# Altium project IMU_sensor.PrjPcb
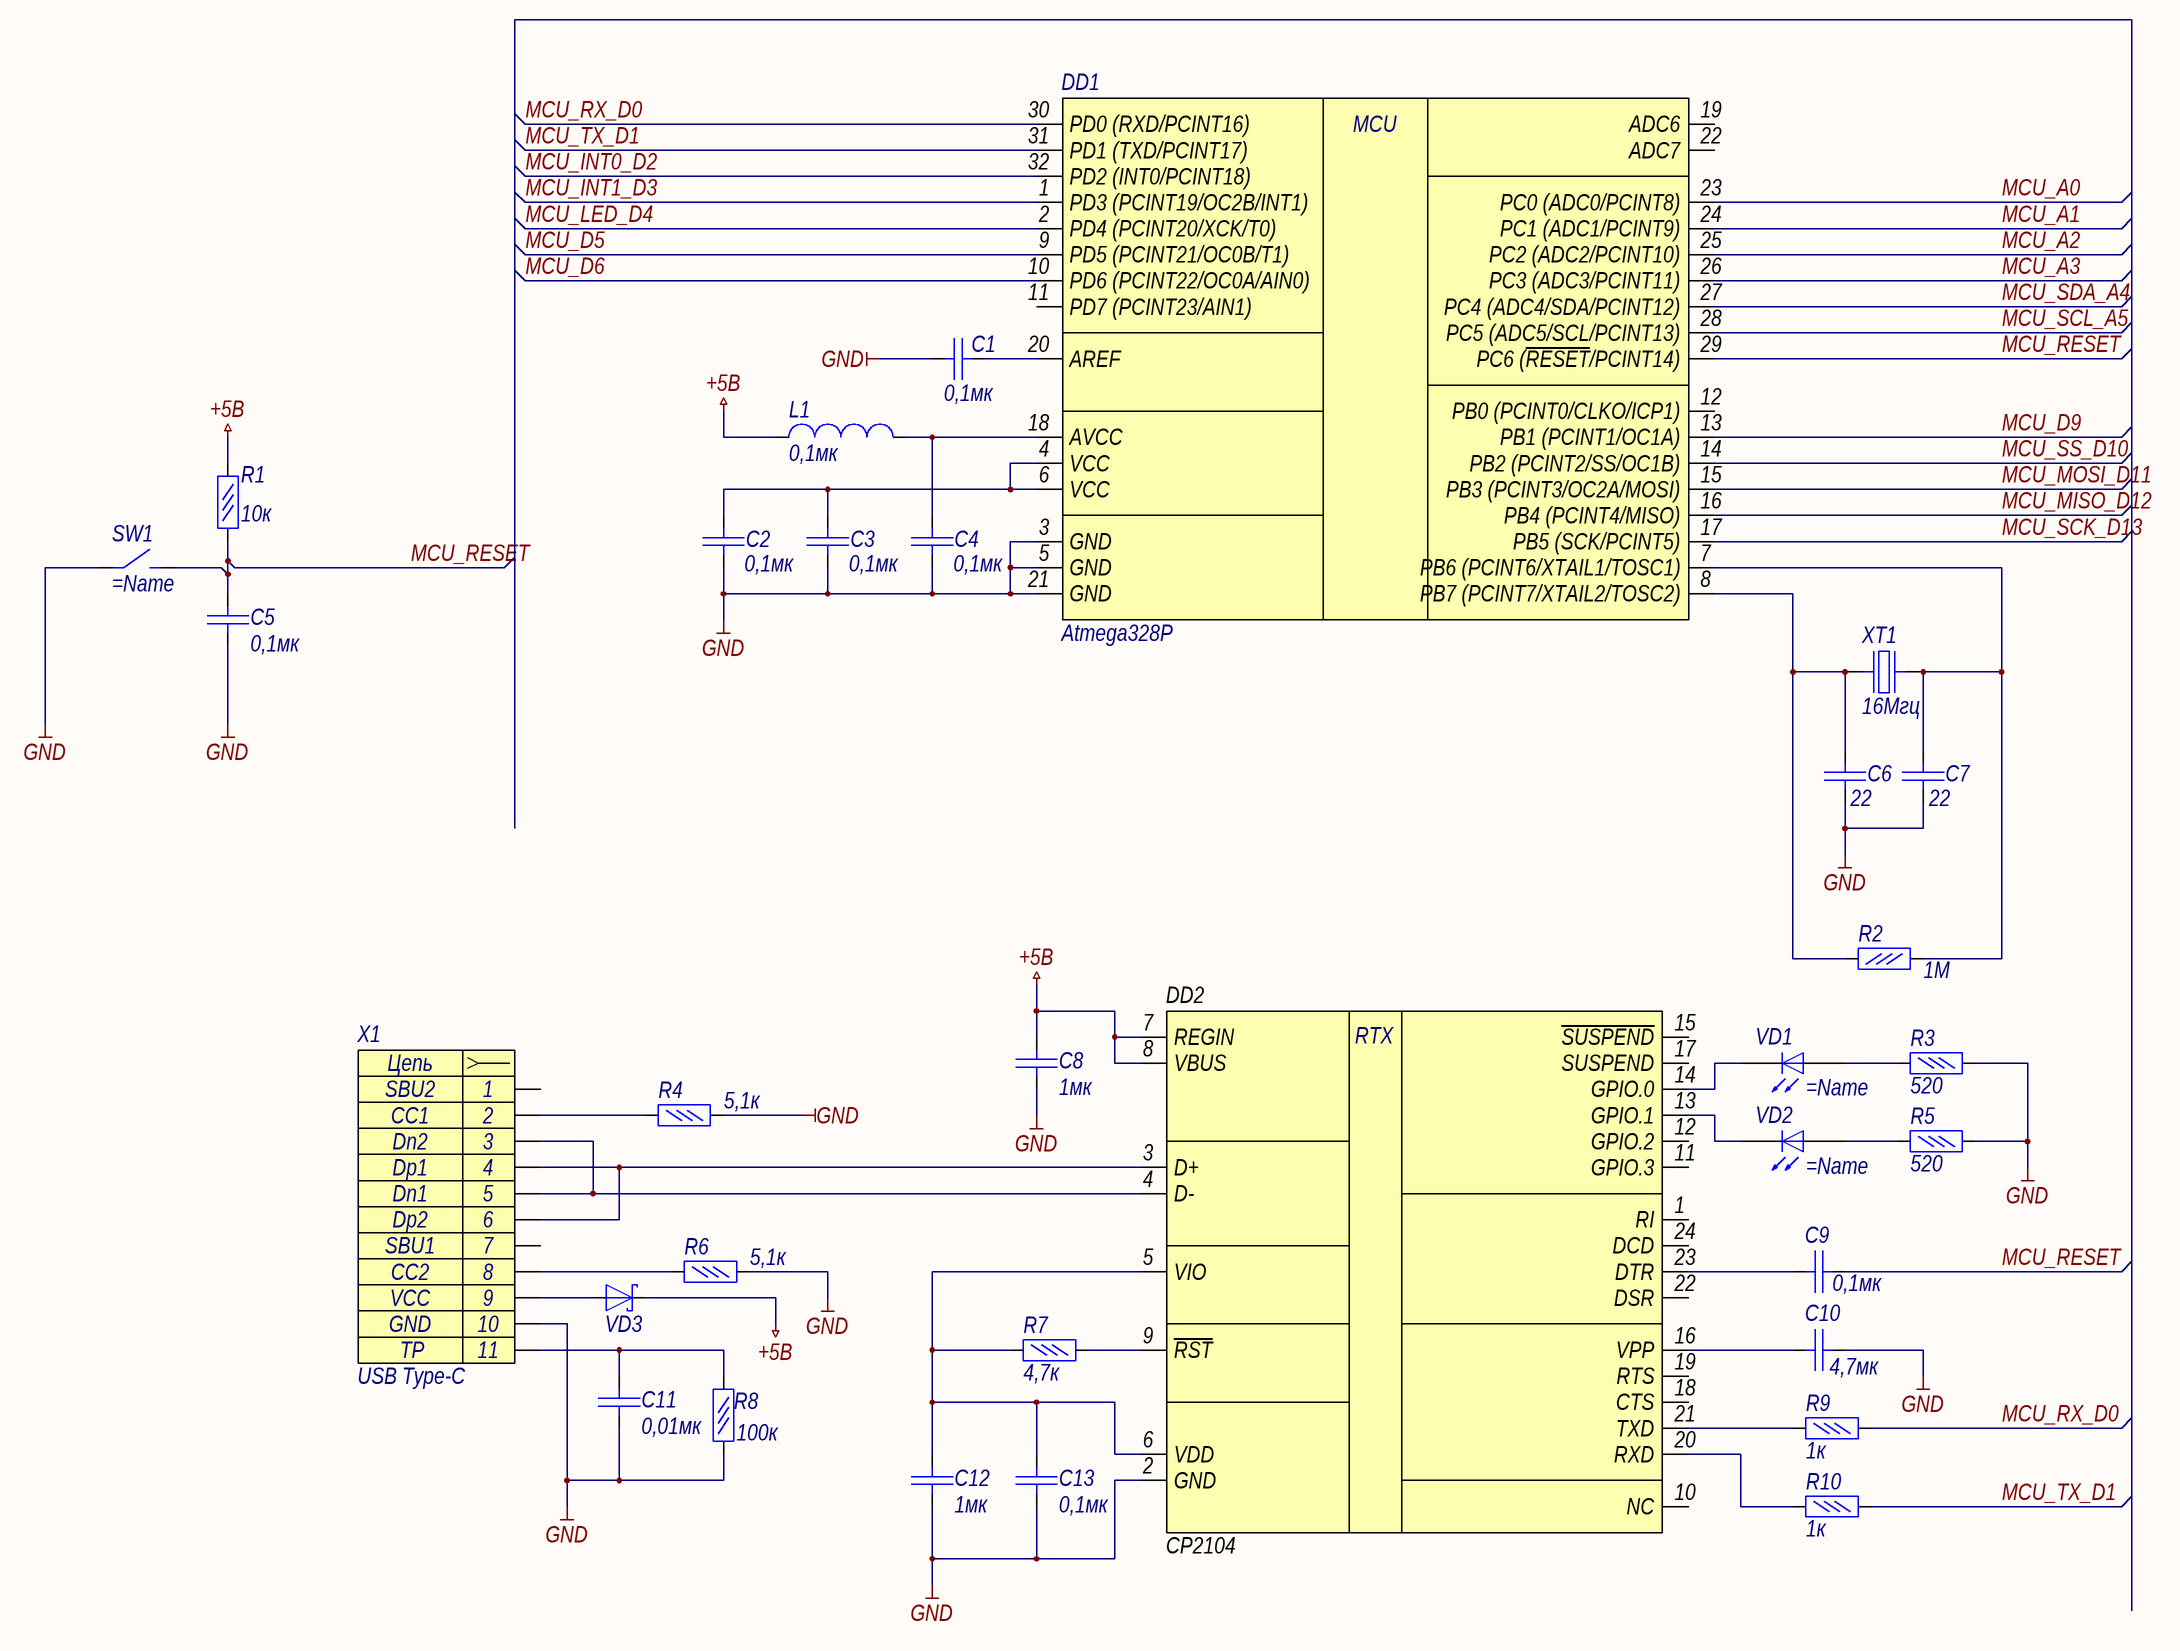
[diagram p0: IMU_sensor_mcu.SchDoc]
4 sheets, 81 parts. Net scope: global (net labels, ports and power ports of the same name join across sheets).
Board file: IMU_sensor.PcbDoc
Sheets:
  IMU_sensor_mcu.SchDoc
  IMU_sensor_gyro.SchDoc
  IMU_sensor_pwr.SchDoc
  MCU_sensor_peripherial.SchDoc

## Sheet IMU_sensor_mcu.SchDoc
size 594 x 420 mm; SheetNumber: 1; SheetTotal: 4

### Parts
DD1  Atmega328P  [VQFN32]
DD2  CP2104  [QFN24-PAD]
L1  0,1мк  [L0603]
R1  10к  [R0402]
R2  1М  [R0402]
R3  520  [R0402]
R4  5,1к  [R0402]
R5  520  [R0402]
R6  5,1к  [R0402]
R7  4,7к  [R0402]
R8  100к  [R0402]
R9  1к  [R0402]
R10  1к  [R0402]
SW1  (no value)  [it-1187]
VD1  (no value)  [0603 - led]
VD2  (no value)  [0603 - led]
VD3  (no value)  [SOD323]
X1  USB Type-C  [USB4105-15-A-120]
XT1  16Мгц  [KX-7]
С1  0,1мк  [C0402]
С2  0,1мк  [C0402]
С3  0,1мк  [C0402]
С4  0,1мк  [C0402]
С5  0,1мк  [C0603]
С6  22  [C0402]
С7  22  [C0402]
С8  1мк  [C0402]
С9  0,1мк  [C0402]
С10  4,7мк  [C0603]
С11  0,01мк  [C0402]
С12  1мк  [C0402]
С13  0,1мк  [C0402]

### Nets
+5В: DD2.7(REGIN) DD2.8(VBUS) L1.2 R1.1 VD3.1(K) С8.1
GND: DD1.3(GND) DD1.5(GND) DD1.21(GND) DD2.2(GND) R3.2 R4.2 R5.2 R6.2 R8.1 SW1.1 X1.10(VCC) С1.1 С2.1 С3.1 С4.1 С5.2 С6.1 С7.1 С8.2 С10.1 С11.1 С12.1 С13.1
MCU_A0: DD1.23(PC0_(ADC0/PCINT8))
MCU_A1: DD1.24(PC1_(ADC1/PCINT9))
MCU_A2: DD1.25(PC2_(ADC2/PCINT10))
MCU_A3: DD1.26(PC3_(ADC3/PCINT11))
MCU_D5: DD1.9(PD5_(PCINT21/OC0B/T1))
MCU_D6: DD1.10(PD6_(PCINT22/OC0A/AIN0))
MCU_D9: DD1.13(PB1_(PCINT1/OC1A))
MCU_INT0_D2: DD1.32(PD2_(INT0/PCINT18))
MCU_INT1_D3: DD1.1(PD3_(PCINT19/OC2B/INT1))
MCU_LED_D4: DD1.2(PD4_(PCINT20/XCK/T0))
MCU_MISO_D12: DD1.16(PB4_(PCINT4/MISO))
MCU_MOSI_D11: DD1.15(PB3_(PCINT3/OC2A/MOSI))
MCU_RESET: DD1.29(PC6_(~{RESET}/PCINT14)) R1.2 SW1.2 С5.1 С9.1
MCU_RX_D0: DD1.30(PD0_(RXD/PCINT16)) R9.2
MCU_SCK_D13: DD1.17(PB5_(SCK/PCINT5))
MCU_SCL_A5: DD1.28(PC5_(ADC5/SCL/PCINT13))
MCU_SDA_A4: DD1.27(PC4_(ADC4/SDA/PCINT12))
MCU_SS_D10: DD1.14(PB2_(PCINT2/SS/OC1B))
MCU_TX_D1: DD1.31(PD1_(TXD/PCINT17)) R10.2
NetDD1_4: DD1.4(VCC) DD1.6(VCC) С2.2 С3.2
NetDD1_7: DD1.7(PB6_(PCINT6/XTAIL1/TOSC1)) R2.2 XT1.3 С7.2
NetDD1_8: DD1.8(PB7_(PCINT7/XTAIL2/TOSC2)) R2.1 XT1.1 С6.2
NetDD1_18: DD1.18(AVCC) L1.1 С4.2
NetDD1_20: DD1.20(AREF) С1.2
NetDD2_3: DD2.3(D+) X1.4(A6) X1.6(B6)
NetDD2_4: DD2.4(D-) X1.3(B7) X1.5(A7)
NetDD2_5: DD2.5(VIO) DD2.6(VDD) R7.2 С12.2 С13.2
NetDD2_9: DD2.9(~{RST}) R7.1
NetDD2_13: DD2.13(GPIO.1) VD2.2(K)
NetDD2_14: DD2.14(GPIO.0) VD1.2(K)
NetDD2_16: DD2.16(VPP) С10.2
NetDD2_20: DD2.20(RXD) R10.1
NetDD2_21: DD2.21(TXD) R9.1
NetDD2_23: DD2.23(DTR) С9.2
NetR3_1: R3.1 VD1.1(A)
NetR4_1: R4.1 X1.2(A5)
NetR5_1: R5.1 VD2.1(A)
NetR6_1: R6.1 X1.8(B5)
NetR8_2: R8.2 X1.TP С11.2
NetVD3_2: VD3.2(A) X1.9(GND)

Not connected (* = marked no-connect by the designer): DD1 11(PD7_(PCINT23/AIN1)) 12(PB0_(PCINT0/CLKO/ICP1)) 19(ADC6) 22(ADC7); DD2 1(RI) 10(NC) 11(GPIO.3) 12(GPIO.2) 15(~{SUSPEND}) 17(SUSPEND) 18(CTS) 19(RTS) 22(DSR) 24(DCD); X1 1(B8) 7(A8)

### Notes on the sheet
- Перв. примен.
- Справ. №
- Подп. и дата
- Инв. № дубл.
- Нормоконтроль:
- Взам. инв. №
- Изм.
- Лист
- № докум.
- Подп.
- Дата
- Лит.
- Масса
- Масштаб
- Т.контр.
- Пров.
- Разраб.
- Листов
- Разработал:
- Инв. № подл.
- Н.контр.
- Утв.
- Копировал
- Формат
- А2
- (in symbol Atmega328P) MCU
- (in symbol CP2104) RTX
- (in symbol USB4105) Цепь; 11

### Library data of the parts
DD1 = Atmega328P: Atmega328P-MU; Name: Atmega328P
L1 = индуктивность: Value: 0,1мк
R1-R10 = Резистор 0.05Вт: Резистор 0,05Вт
  R1: Value: 10к
  R2: Value: 1М
  R3 R5: Value: 520
  R4 R6: Value: 5,1к
  R7: Value: 4,7к
  R8: Value: 100к
  R9 R10: Value: 1к
SW1 = button
VD1 VD2 = smd_led: smd led
VD3 = DiodeSchottky: Диод Шоттки
X1 = USB4105: USB Type-C USB4105-GF-A / GCT; Contact_1: SBU2; Contact_2: CC1; Contact_3: Dn2; Contact_4: Dp1; Contact_5: Dn1; Contact_6: Dp2; Contact_7: SBU1; Contact_8: CC2; Contact_9: VCC; Contact_10: GND; Name: USB Type-C
XT1 = Резонатор: 12.88605 / Geyer; Name: 12.88605; Value: 16Мгц
С1-С13 = Кер. конденсатор
  С1-С5 С9 С13: Value: 0,1мк
  С6 С7: Value: 22
  С8 С12: Value: 1мк
  С10: Value: 4,7мк
  С11: Value: 0,01мк
DD2 = CP2104: Наименование: CP2104

## Sheet IMU_sensor_gyro.SchDoc
size 420 x 297 mm; SheetNumber: 2; SheetTotal: 4
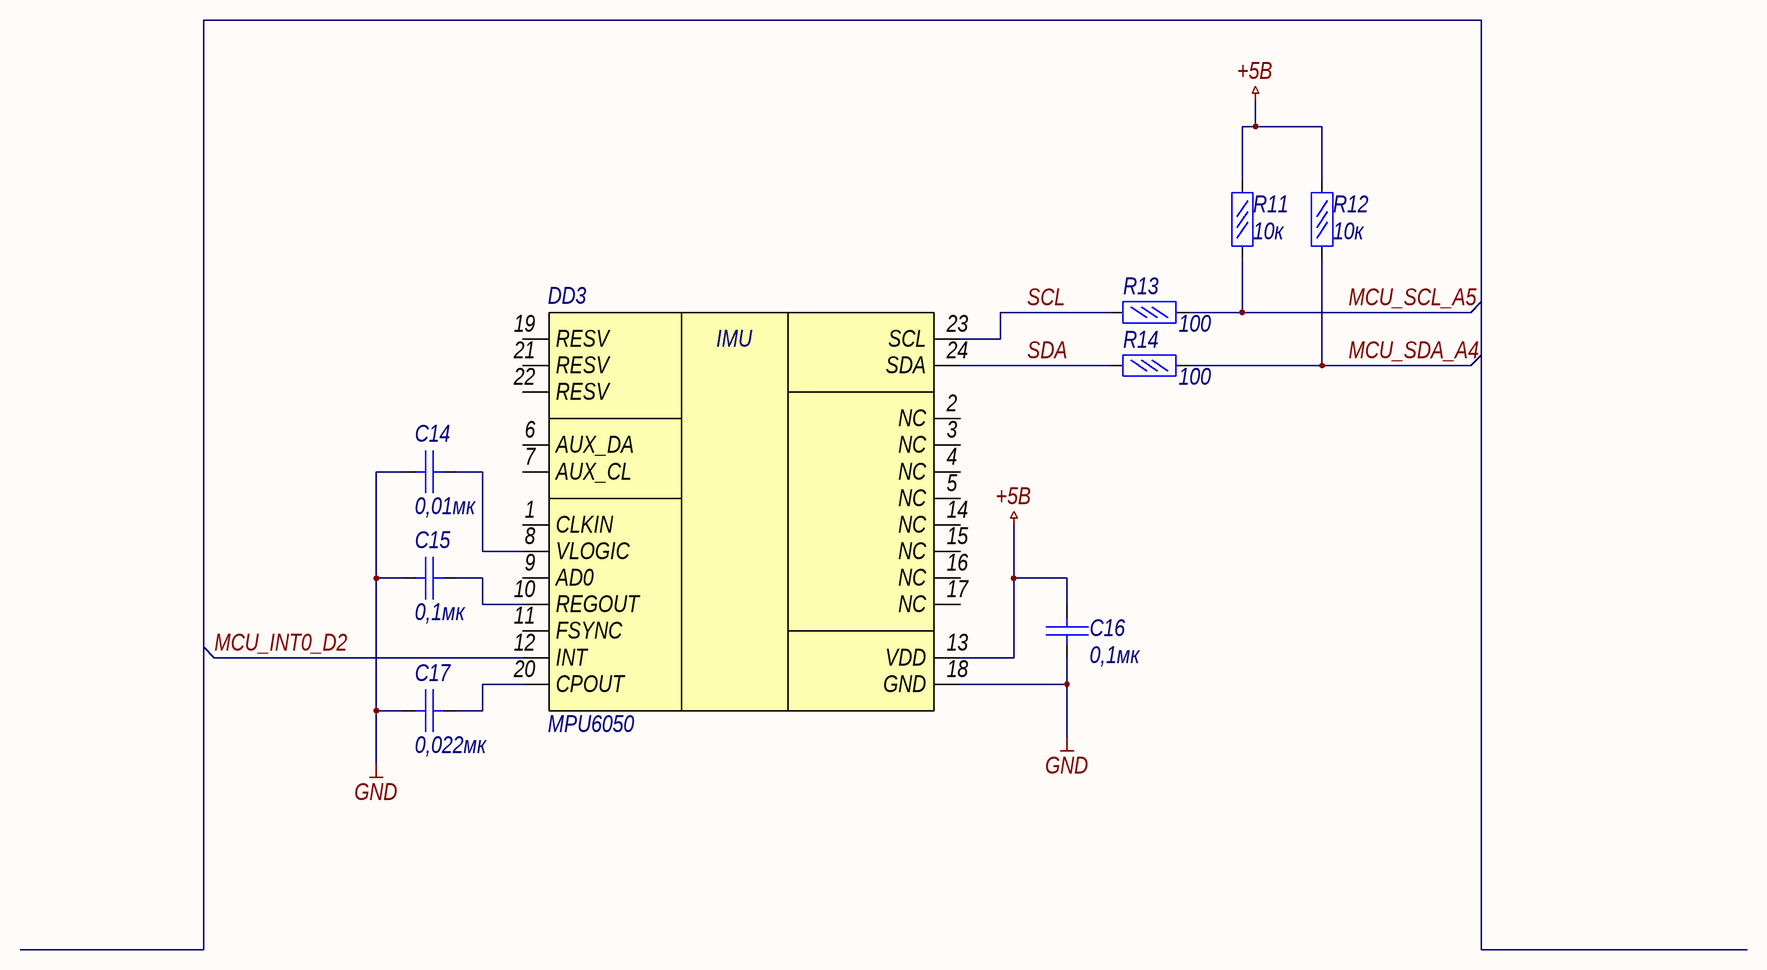
[diagram p1: IMU_sensor_gyro.SchDoc]

### Parts
DD3  MPU6050  [QFN24-PAD]
R11  10к  [R0402]
R12  10к  [R0402]
R13  100  [R0402]
R14  100  [R0402]
С14  0,01мк  [C0402]
С15  0,1мк  [C0402]
С16  0,1мк  [C0402]
С17  0,022мк  [C0402]

### Nets
+5В: DD3.13(VDD) R11.2 R12.2 С16.2
GND: DD3.18(GND) С14.1 С15.1 С16.1 С17.1
MCU_INT0_D2: DD3.12(INT)
MCU_SCL_A5: R11.1 R13.1
MCU_SDA_A4: R12.1 R14.1
SCL: DD3.23(SCL) R13.2
SDA: DD3.24(SDA) R14.2
NetDD3_8: DD3.8(VLOGIC) С14.2
NetDD3_10: DD3.10(REGOUT) С15.2
NetDD3_20: DD3.20(CPOUT) С17.2

Not connected (* = marked no-connect by the designer): DD3 1(CLKIN) 2(NC) 3(NC) 4(NC) 5(NC) 6(AUX_DA) 7(AUX_CL) 9(AD0) 11(FSYNC) 14(NC) 15(NC) 16(NC) 17(NC) 19(RESV) 21(RESV) 22(RESV)

### Notes on the sheet
- Подп. и дата
- Инв. № дубл.
- Взам. инв. №
- Инв. № подл.
- Лист
- Изм.
- № докум.
- Подп.
- Дата
- Копировал
- Формат
- А3
- (in symbol MPU6050) IMU

### Library data of the parts
R11-R14 = Резистор 0.05Вт: Резистор 0,05Вт
  R11 R12: Value: 10к
  R13 R14: Value: 100
С14-С17 = Кер. конденсатор
  С14: Value: 0,01мк
  С15 С16: Value: 0,1мк
  С17: Value: 0,022мк
DD3 = MPU6050: Name: MPU6050

## Sheet IMU_sensor_pwr.SchDoc
size 420 x 297 mm; SheetNumber: 3; SheetTotal: 4
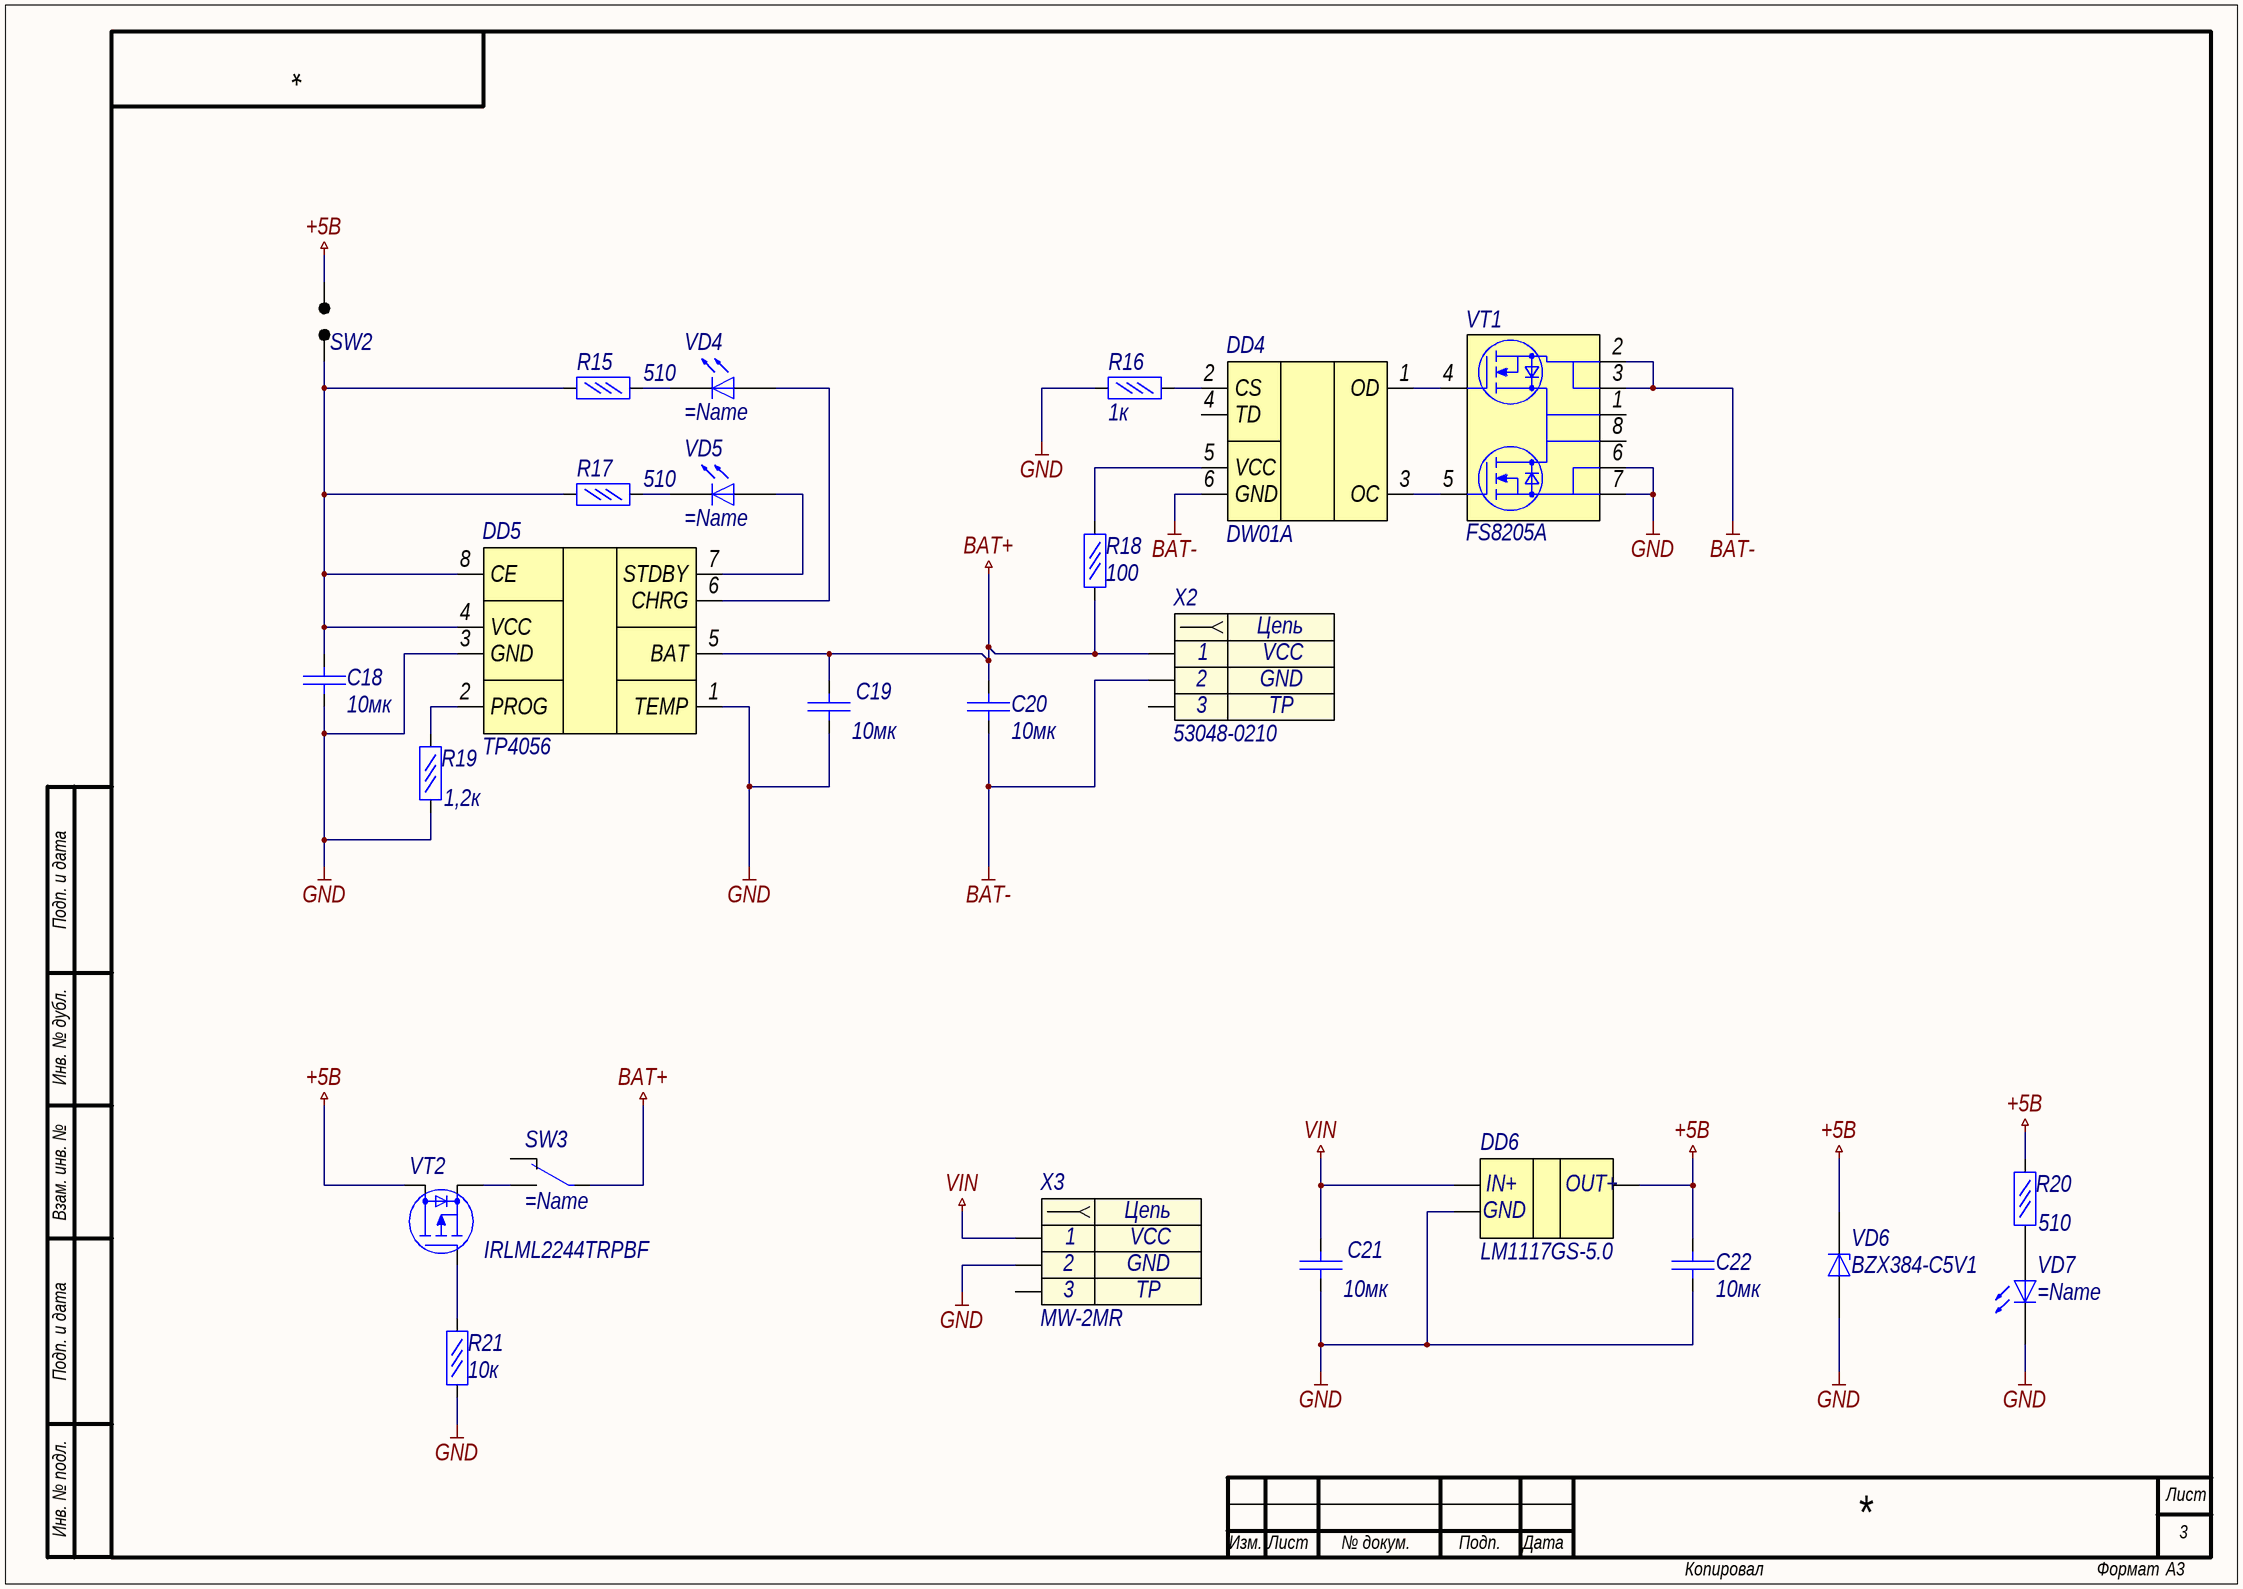
[diagram p2: IMU_sensor_pwr.SchDoc]

### Parts
DD4  DW01A  [SOT23-6]
DD5  TP4056  [SOP-8]
DD6  LM1117GS-5.0  [SOT-223]
R15  510  [R0402]
R16  1к  [R0402]
R17  510  [R0402]
R18  100  [R0402]
R19  1,2к  [R0402]
R20  510  [R0402]
R21  10к  [R0402]
SW2  (no value)  [Jumper_0.5x1]
SW3  (no value)  [MK12C02]
VD4  (no value)  [0603 - led]
VD5  (no value)  [0603 - led]
VD6  BZX384-C5V1  [SOD323]
VD7  (no value)  [0603 - led]
VT1  FS8205A  [TSSOP-8]
VT2  IRLML2244TRPBF  [SOT23]
X2  53048-0210  [53048-0210]
X3  MW-2MR  [MW-2MR]
С18  10мк  [C0603]
С19  10мк  [C0603]
С20  10мк  [C0603]
С21  10мк  [C0603]
С22  10мк  [C0603]

### Nets
+5В: DD6.2 R20.2 SW2.2 VD6.2(K) VT2.3(D) С22.2
BAT+: DD5.5(BAT) R18.2 SW3.1 X2.1 С19.2 С20.1
BAT-: DD4.6(GND) VT1.2(S1) VT1.3(S1) X2.2 С20.2
GND: DD5.1(TEMP) DD5.3(GND) DD6.1 R16.2 R19.1 R21.2 VD6.1(A) VD7.2(K) VT1.6(S2) VT1.7(S2) X3.2 С18.2 С19.1 С21.1 С22.1
VIN: DD6.3 X3.1 С21.2
NetDD4_1: DD4.1(OD) VT1.4(G1)
NetDD4_2: DD4.2(CS) R16.1
NetDD4_3: DD4.3(OC) VT1.5(G2)
NetDD4_5: DD4.5(VCC) R18.1
NetDD5_2: DD5.2(PROG) R19.2
NetDD5_4: DD5.4(VCC) DD5.8(CE) R15.2 R17.2 SW2.1 С18.1
NetDD5_6: DD5.6(CHRG) VD4.1(A)
NetDD5_7: DD5.7(STDBY) VD5.1(A)
NetR15_1: R15.1 VD4.2(K)
NetR17_1: R17.1 VD5.2(K)
NetR20_1: R20.1 VD7.1(A)
NetR21_1: R21.1 VT2.1(G)
NetSW3_3: SW3.3 VT2.2(S)

Not connected (* = marked no-connect by the designer): DD4 4(TD); SW3 2; VT1 1(D12) 8(D12); X2 0; X3 0

### Notes on the sheet
- Подп. и дата
- Инв. № дубл.
- Взам. инв. №
- Инв. № подл.
- Лист
- Изм.
- № докум.
- Подп.
- Дата
- Копировал
- Формат
- А3
- (in symbol Header_2) Цепь; 3

### Library data of the parts
DD4 = DW01A: контроллер заряда; Name: DW01A
DD5 = TP4056: линейное зарядное устройство; Name: TP4056
DD6 = LM1117: Contact_1: IN+; Contact_2: GND; Contact_3: OUT+; Name: LM1117GS-5.0
R15-R21 = Резистор 0.05Вт: Резистор 0,05Вт
  R15 R17 R20: Value: 510
  R16: Value: 1к
  R18: Value: 100
  R19: Value: 1,2к
  R21: Value: 10к
SW2 = Jumper: Запаиваемая перемычка
SW3 = switch
VD4 VD5 VD7 = smd_led: smd led
VD6 = стабилитрон: Name: BZX384-C5V1
VT1 = FS8205A: мофсфет; Name: FS8205A
VT2 = IRLML2244TRPBF: мосфет n-канал IRLML2244TRPBF; Name: IRLML2244TRPBF
X2 X3 = Header_2: Разъем - 3 конт. розетка; Contact_1: VCC; Contact_2: GND; Contact_3: TP
  X2: Name: 53048-0210
  X3: Name: MW-2MR
С18-С22 = Кер. конденсатор: Value: 10мк

## Sheet MCU_sensor_peripherial.SchDoc
size 420 x 297 mm; SheetNumber: 4; SheetTotal: 4
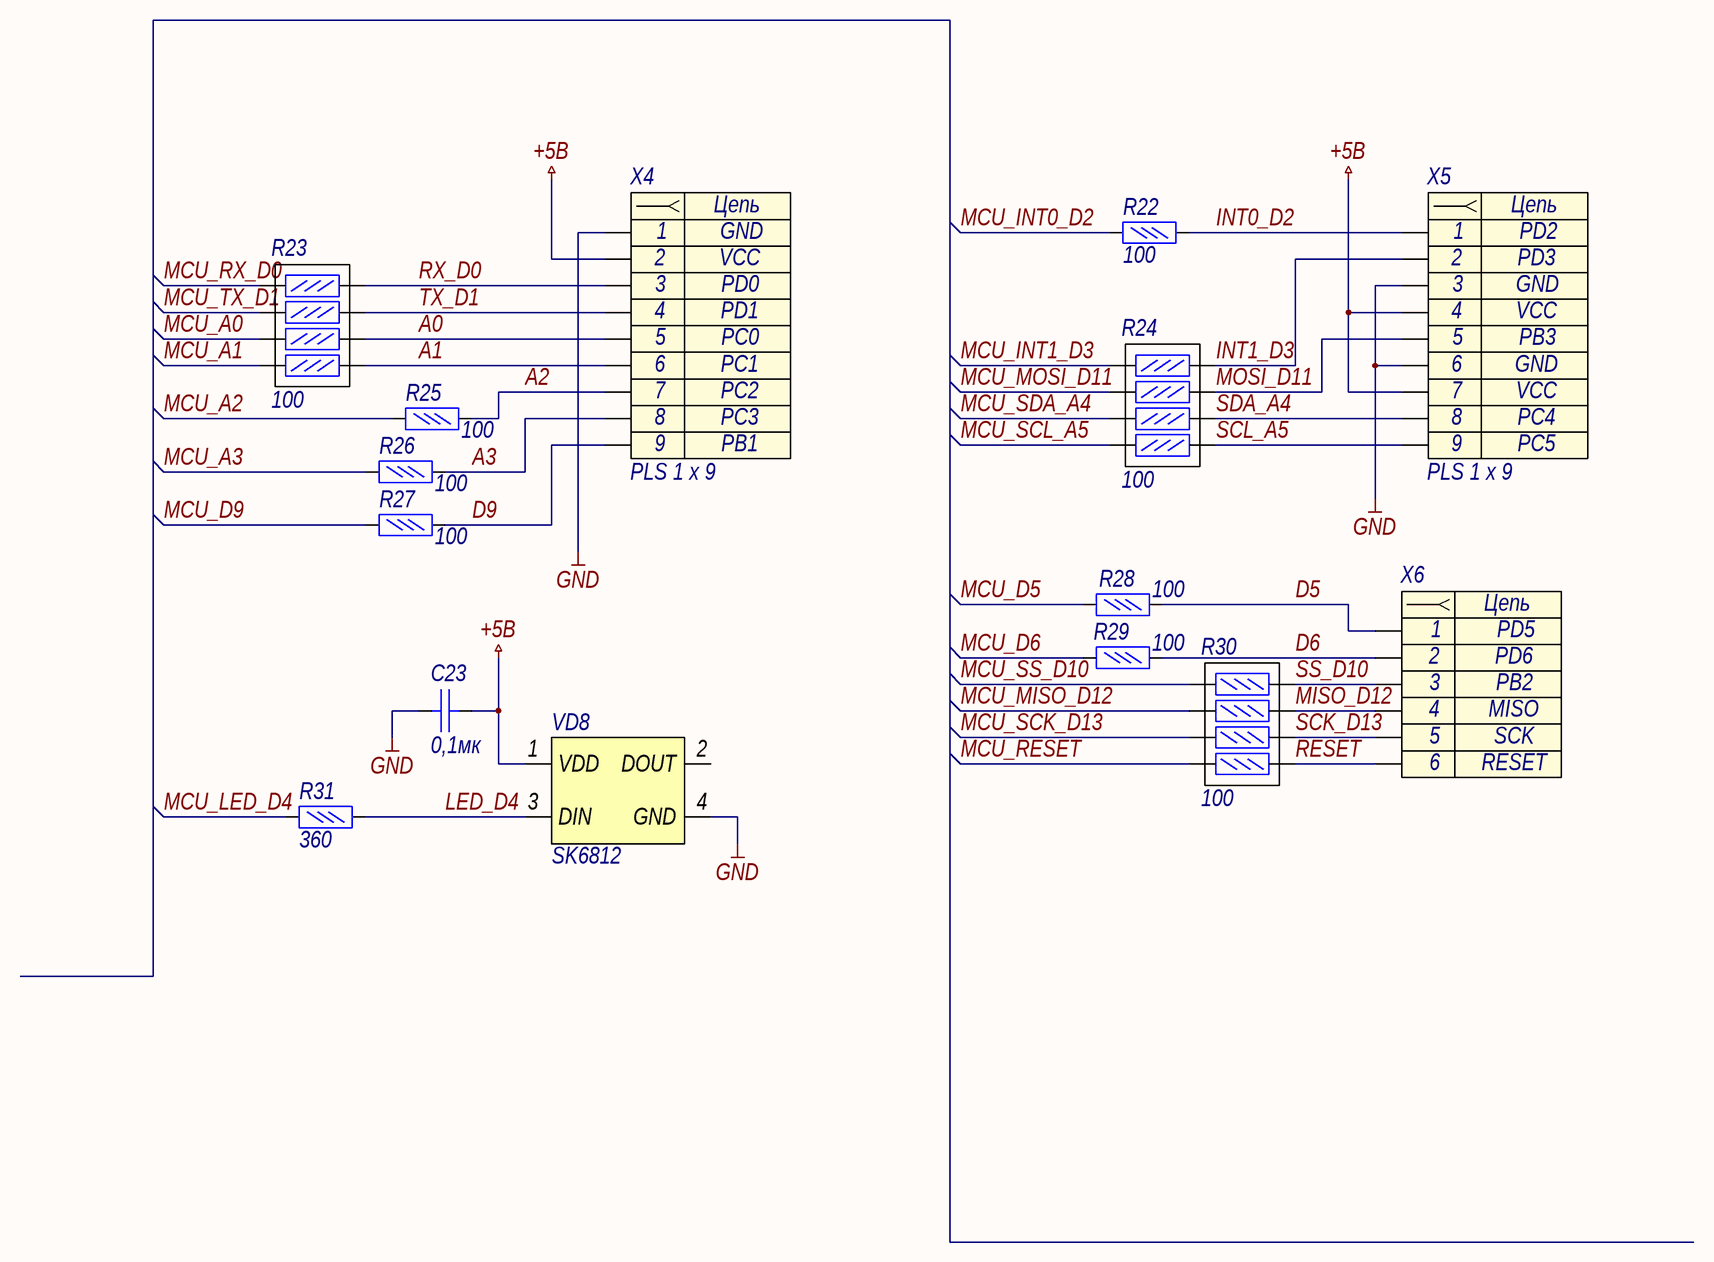
[diagram p3: MCU_sensor_peripherial.SchDoc]

### Parts
R22  100  [R0402]
R23  100  [R0402x4]
R24  100  [R0402x4]
R25  100  [R0402]
R26  100  [R0402]
R27  100  [R0402]
R28  100  [R0402]
R29  100  [R0402]
R30  100  [R0402x4]
R31  360  [R0402]
VD8  SK6812  [3535]
X4  PLS 1 x 9  [PLS2-9 - emty]
X5  PLS 1 x 9  [PLS2-9 - emty]
X6  (no value)  [PLS2-6 - emty]
С23  0,1мк  [C0402]

### Nets
+5В: VD8.1(VDD) X4.2 X5.4 X5.7 С23.2
GND: VD8.4(GND) X4.1 X5.3 X5.6 С23.1
A0: R23.5 X4.5
A1: R23.7 X4.6
A2: R25.2 X4.7
A3: R26.2 X4.8
D5: R28.2 X6.1
D6: R29.2 X6.2
D9: R27.2 X4.9
INT0_D2: R22.2 X5.1
INT1_D3: R24.1 X5.2
LED_D4: R31.2 VD8.3(DIN)
MCU_A0: R23.6
MCU_A1: R23.8
MCU_A2: R25.1
MCU_A3: R26.1
MCU_D5: R28.1
MCU_D6: R29.1
MCU_D9: R27.1
MCU_INT0_D2: R22.1
MCU_INT1_D3: R24.2
MCU_LED_D4: R31.1
MCU_MISO_D12: R30.3
MCU_MOSI_D11: R24.4
MCU_RESET: R30.7
MCU_RX_D0: R23.2
MCU_SCK_D13: R30.5
MCU_SCL_A5: R24.8
MCU_SDA_A4: R24.6
MCU_SS_D10: R30.1
MCU_TX_D1: R23.4
MISO_D12: R30.4 X6.4
MOSI_D11: R24.3 X5.5
RESET: R30.8 X6.6
RX_D0: R23.1 X4.3
SCK_D13: R30.6 X6.5
SCL_A5: R24.7 X5.9
SDA_A4: R24.5 X5.8
SS_D10: R30.2 X6.3
TX_D1: R23.3 X4.4

Not connected (* = marked no-connect by the designer): VD8 2(DOUT)

### Notes on the sheet
- Подп. и дата
- Инв. № дубл.
- Взам. инв. №
- Инв. № подл.
- Лист
- Изм.
- № докум.
- Подп.
- Дата
- Копировал
- Формат
- А3
- (in symbol PLS 1 x 6) Цепь
- (in symbol PLS 1 x 9) Цепь

### Library data of the parts
R22 R25-R29 R31 = Резистор 0.05Вт: Резистор 0,05Вт
  R22 R25-R29: Value: 100
  R31: Value: 360
R23 R24 R30 = Резисторная сборка 0.05 x 4: Value: 100
VD8 = SK6812: светодиод с пиксельной адресацией SK6812 4020; Name: SK6812
X4 = PLS 1 x 9: Contact_1: GND; Contact_2: VCC; Contact_3: PD0; Contact_4: PD1; Contact_5: PC0; Contact_6: PC1; Contact_7: PC2; Contact_8: PC3; Contact_9: PB1; Name: PLS 1 x 9
X5 = PLS 1 x 9: Contact_1: PD2; Contact_2: PD3; Contact_3: GND; Contact_4: VCC; Contact_5: PB3; Contact_8: PC4; Contact_9: PC5; Contact_6: GND; Contact_7: VCC; Name: PLS 1 x 9
X6 = PLS 1 x 6: Contact_1: PD5; Contact_2: PD6; Contact_3: PB2; Contact_4: MISO; Contact_5: SCK; Contact_6: RESET; Name: PLS 1 x 6
С23 = Кер. конденсатор: Value: 0,1мк

## Nets that join several sheets
+5В: IMU_sensor_mcu (6 pins), IMU_sensor_gyro (DD3.13 R11.2 R12.2 С16.2), IMU_sensor_pwr (6 pins), MCU_sensor_peripherial (5 pins)
GND: IMU_sensor_mcu (23 pins), IMU_sensor_gyro (5 pins), IMU_sensor_pwr (15 pins), MCU_sensor_peripherial (5 pins)
MCU_A0: IMU_sensor_mcu (DD1.23), MCU_sensor_peripherial (R23.6)
MCU_A1: IMU_sensor_mcu (DD1.24), MCU_sensor_peripherial (R23.8)
MCU_A2: IMU_sensor_mcu (DD1.25), MCU_sensor_peripherial (R25.1)
MCU_A3: IMU_sensor_mcu (DD1.26), MCU_sensor_peripherial (R26.1)
MCU_D5: IMU_sensor_mcu (DD1.9), MCU_sensor_peripherial (R28.1)
MCU_D6: IMU_sensor_mcu (DD1.10), MCU_sensor_peripherial (R29.1)
MCU_D9: IMU_sensor_mcu (DD1.13), MCU_sensor_peripherial (R27.1)
MCU_INT0_D2: IMU_sensor_mcu (DD1.32), IMU_sensor_gyro (DD3.12), MCU_sensor_peripherial (R22.1)
MCU_INT1_D3: IMU_sensor_mcu (DD1.1), MCU_sensor_peripherial (R24.2)
MCU_LED_D4: IMU_sensor_mcu (DD1.2), MCU_sensor_peripherial (R31.1)
MCU_MISO_D12: IMU_sensor_mcu (DD1.16), MCU_sensor_peripherial (R30.3)
MCU_MOSI_D11: IMU_sensor_mcu (DD1.15), MCU_sensor_peripherial (R24.4)
MCU_RESET: IMU_sensor_mcu (5 pins), MCU_sensor_peripherial (R30.7)
MCU_RX_D0: IMU_sensor_mcu (DD1.30 R9.2), MCU_sensor_peripherial (R23.2)
MCU_SCK_D13: IMU_sensor_mcu (DD1.17), MCU_sensor_peripherial (R30.5)
MCU_SCL_A5: IMU_sensor_mcu (DD1.28), IMU_sensor_gyro (R11.1 R13.1), MCU_sensor_peripherial (R24.8)
MCU_SDA_A4: IMU_sensor_mcu (DD1.27), IMU_sensor_gyro (R12.1 R14.1), MCU_sensor_peripherial (R24.6)
MCU_SS_D10: IMU_sensor_mcu (DD1.14), MCU_sensor_peripherial (R30.1)
MCU_TX_D1: IMU_sensor_mcu (DD1.31 R10.2), MCU_sensor_peripherial (R23.4)